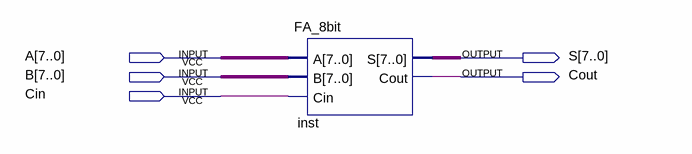
[diagram p0: schematic sheet]
// Quartus schematic FA_8bit.bdf as structural Verilog: 1 symbols, 5 pins
module FA_8bit (
  input  [7:0] A,
  input  [7:0] B,
  input  Cin,
  output [7:0] S,
  output Cout
);

  FA_8bit inst (.A(A), .B(B), .Cin(Cin), .S(S), .Cout(Cout));
endmodule
